# Altium schematic sheet Control_Sense_TOP_VAC.SchDoc (part 1 of 4)
size A1 portrait; SheetNumber: 5; SheetTotal: 5
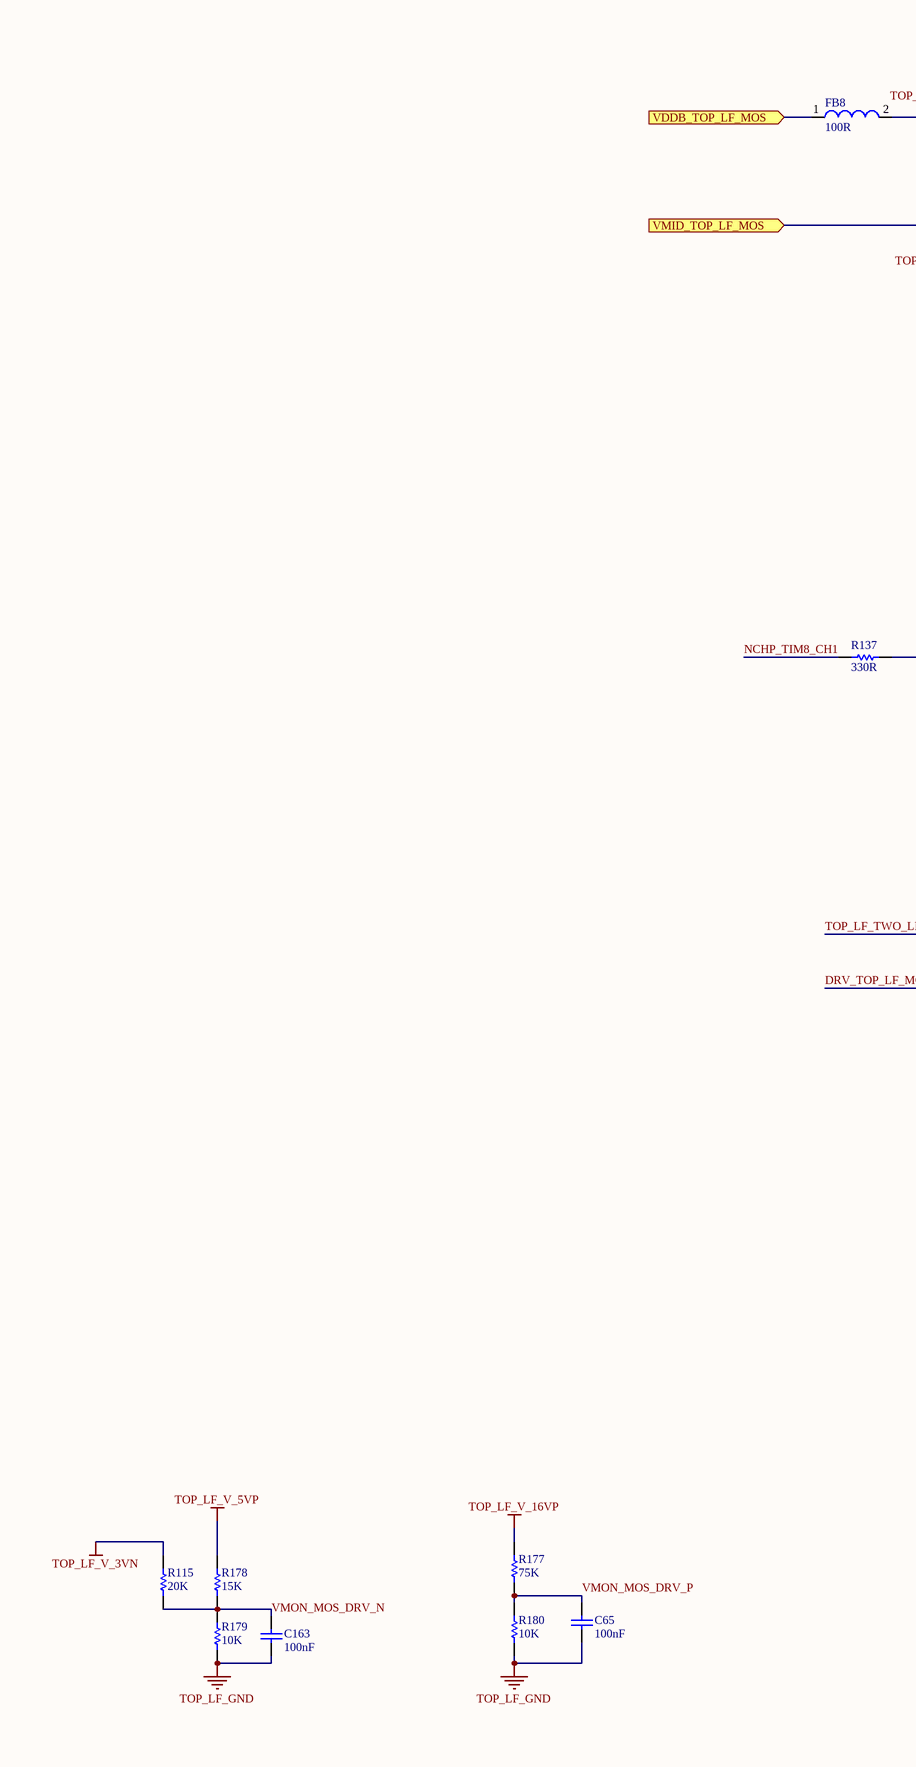
[diagram p0: Control_Sense_TOP_VAC.SchDoc, top left]
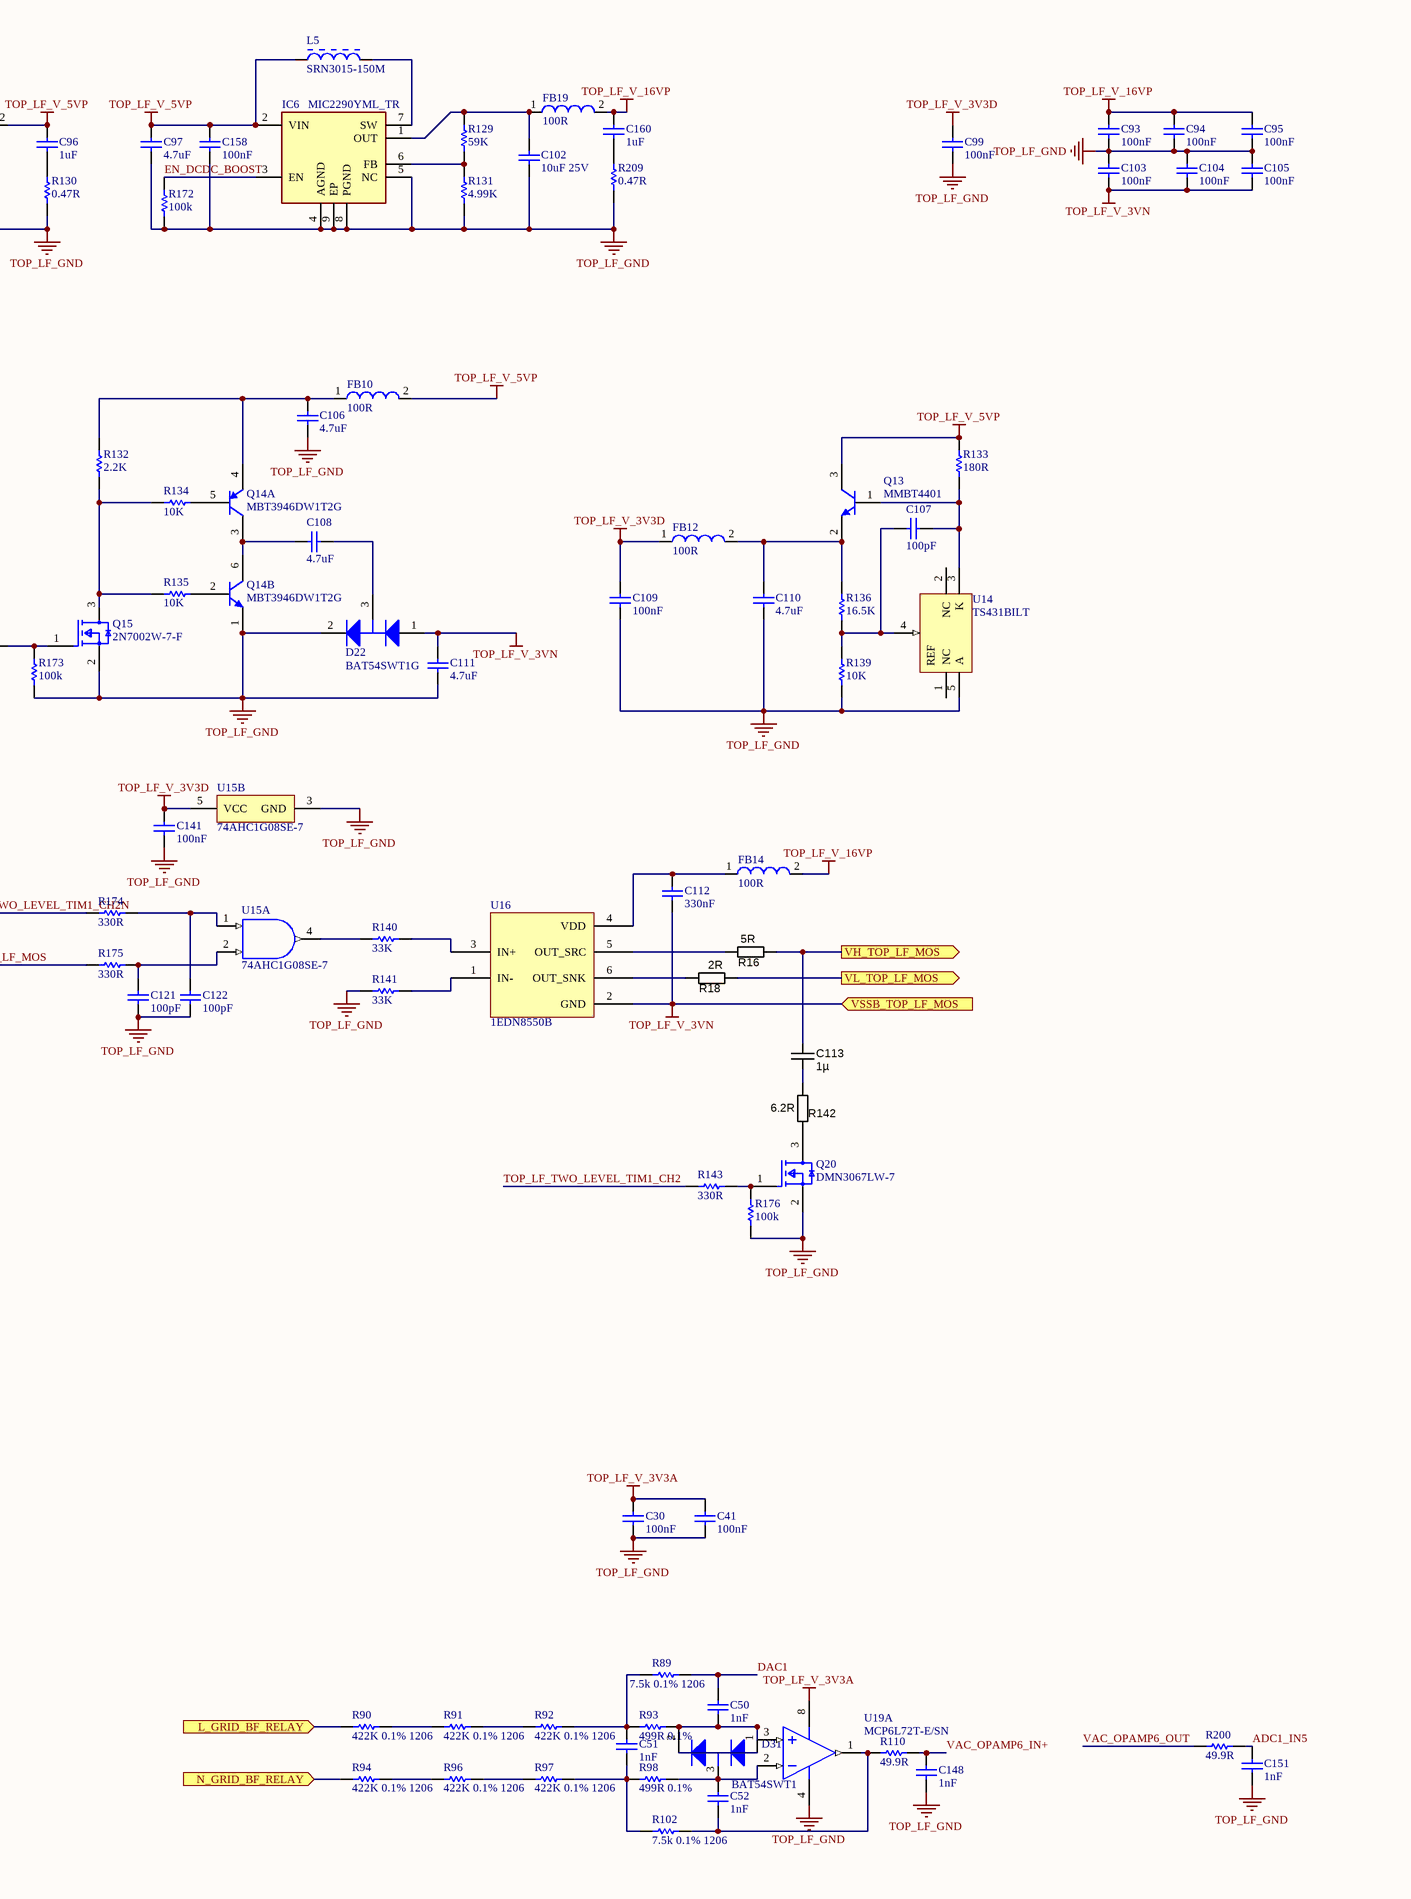
[diagram p1: Control_Sense_TOP_VAC.SchDoc, top right]
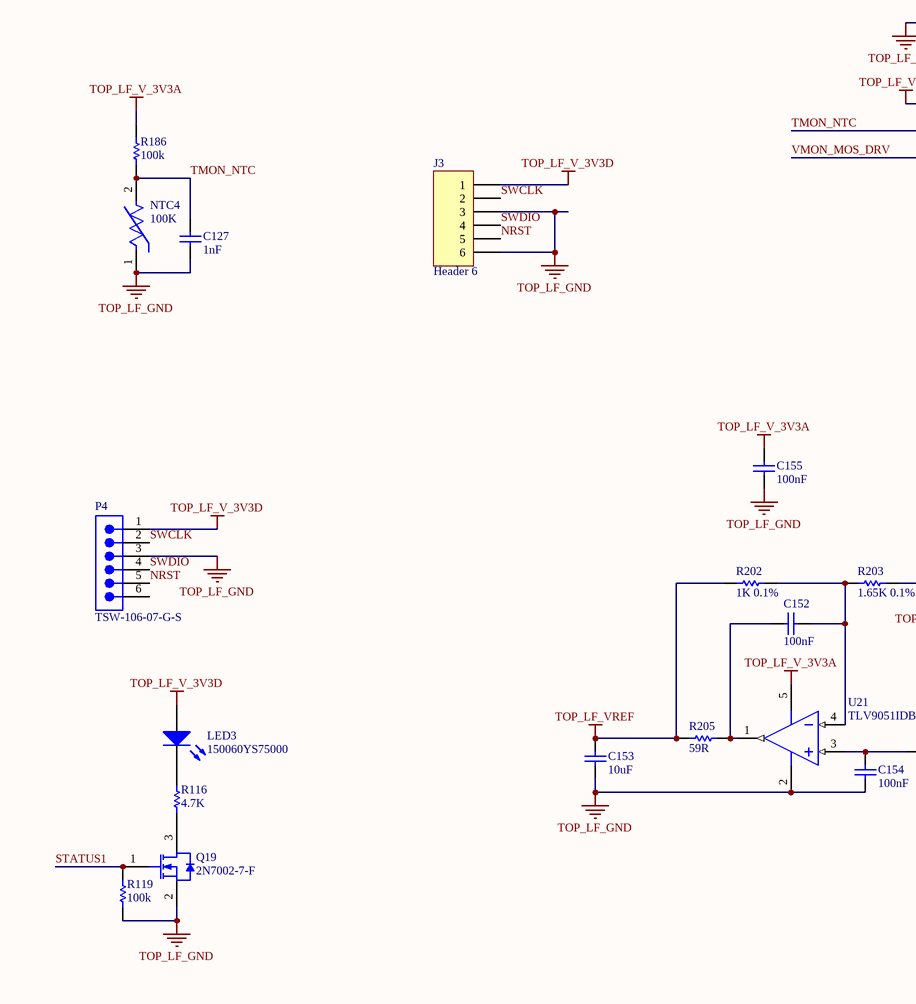
[diagram p2: Control_Sense_TOP_VAC.SchDoc, bottom left]
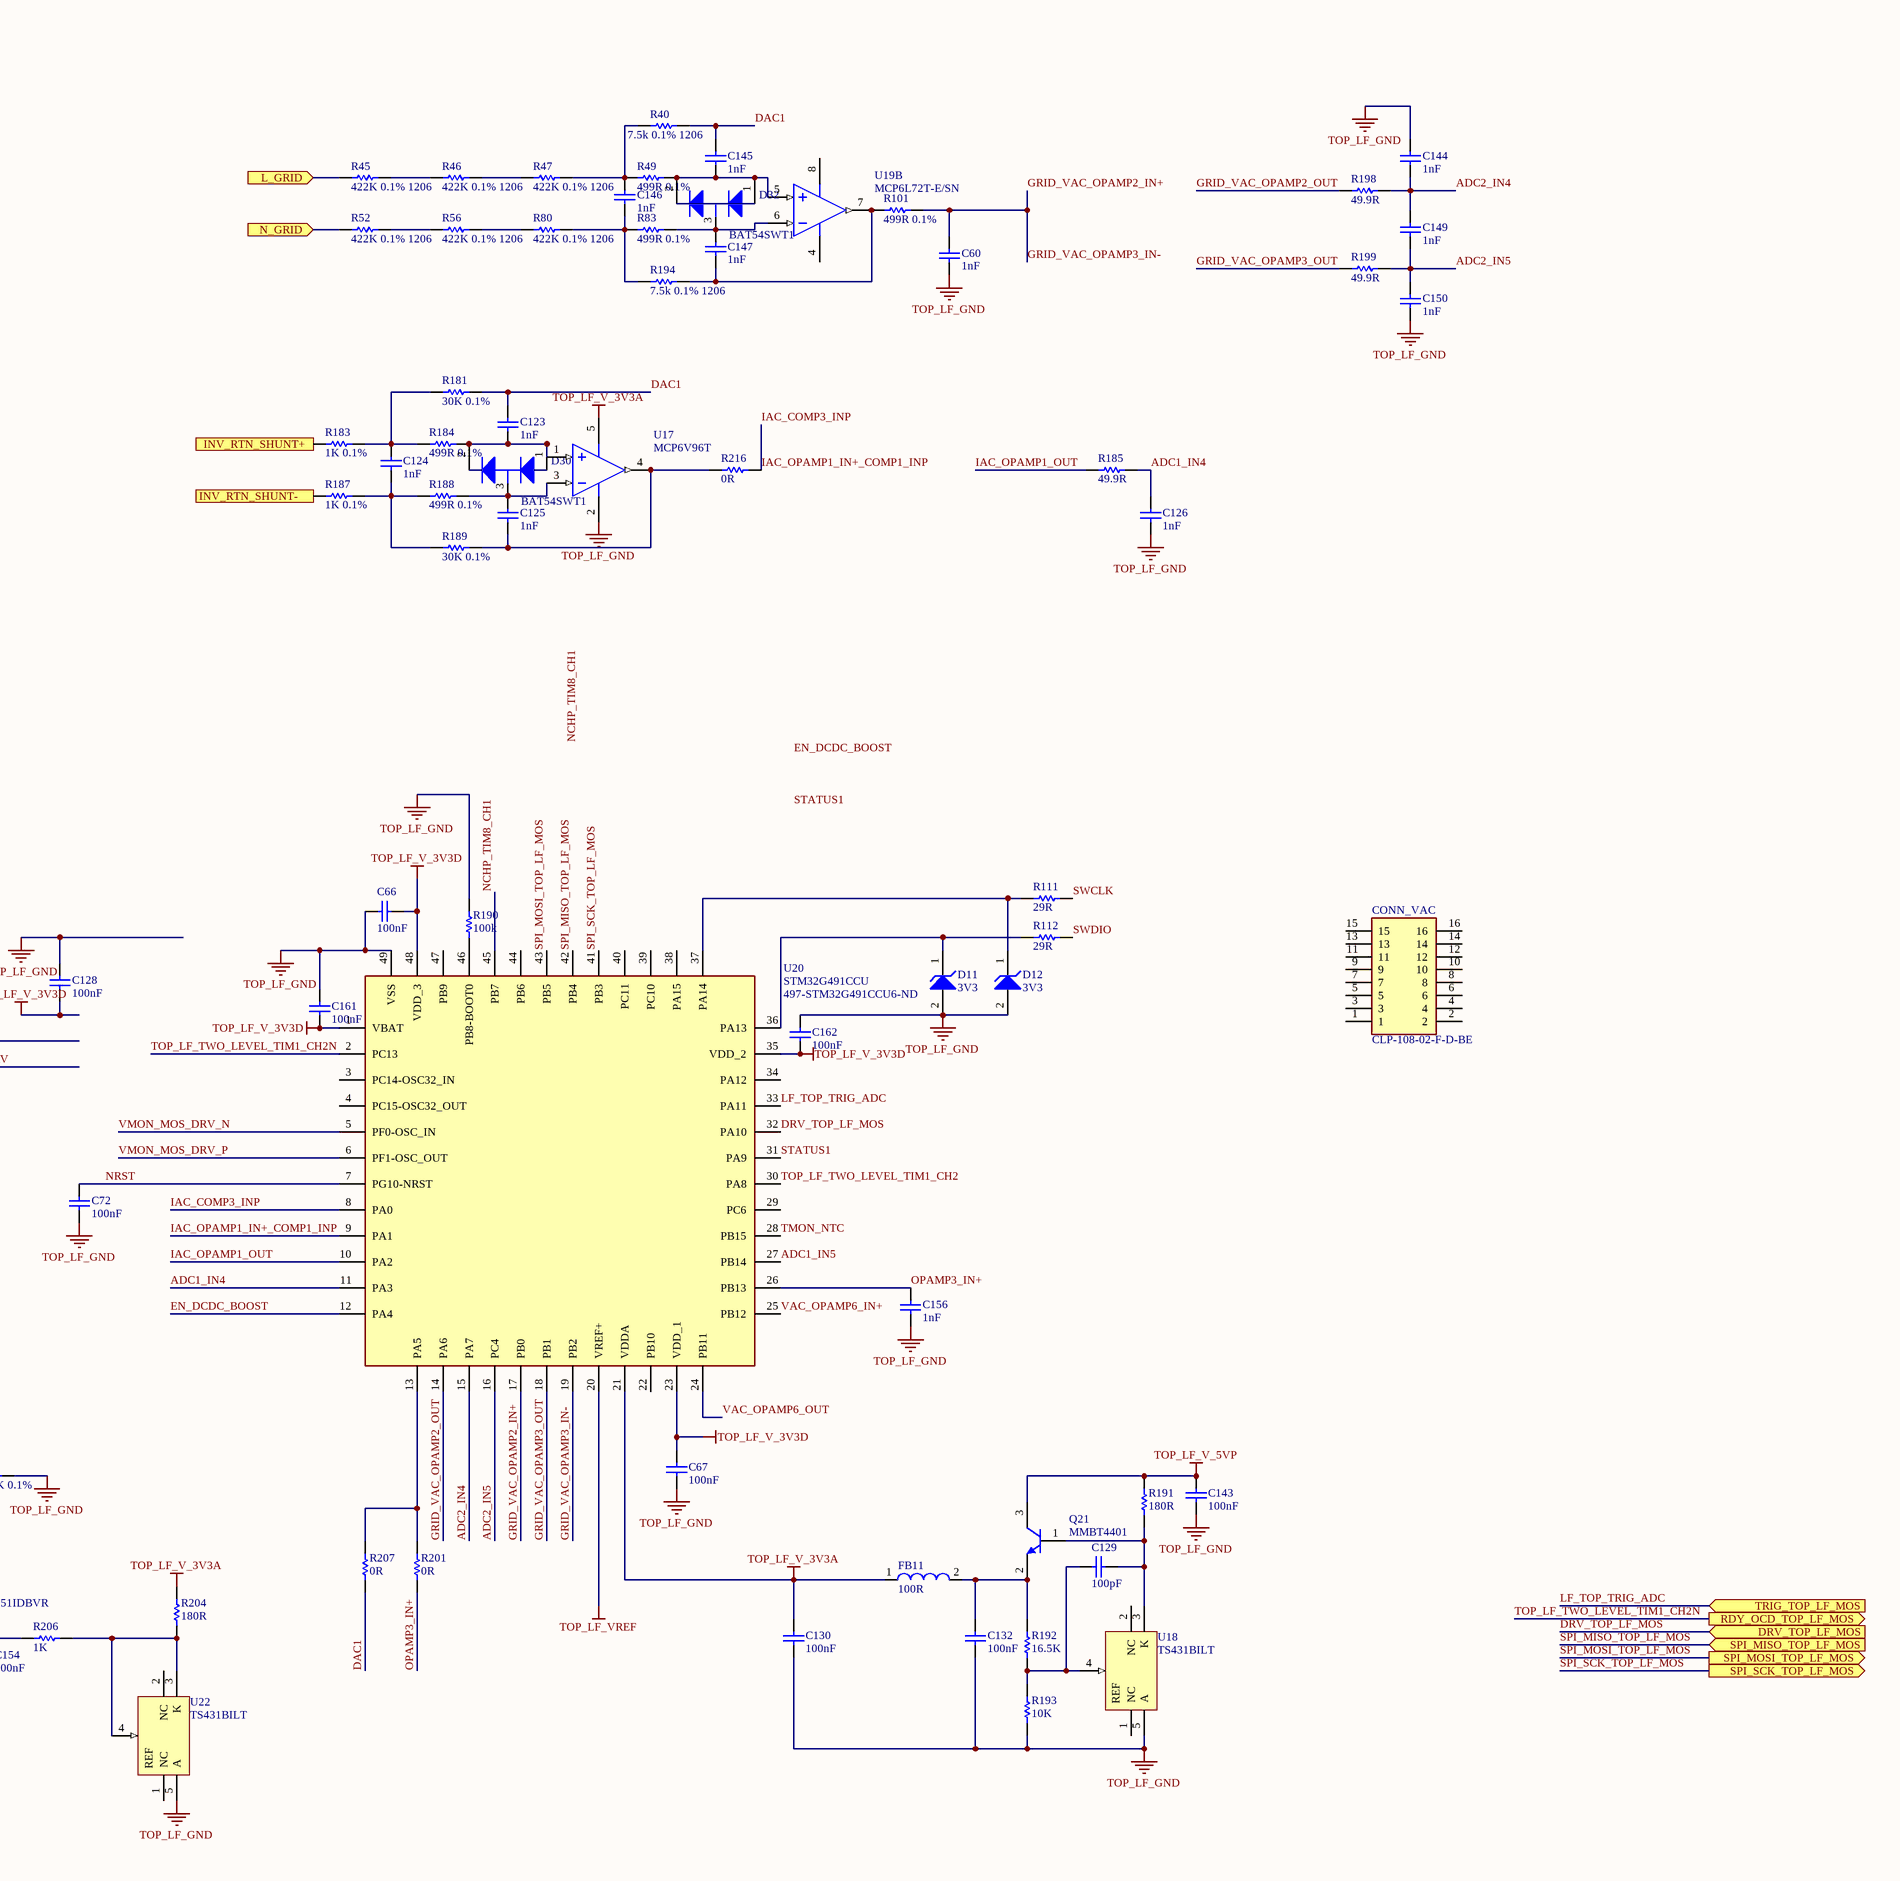
[diagram p3: Control_Sense_TOP_VAC.SchDoc, bottom right]

## Parts
C30  100nF  [SAMS-C0603-2_N]
C41  100nF  [SAMS-C0603-2_N]
C50  1nF  [CAPC1608X90X35NL15T15]
C51  1nF  [CAPC1608X90X35NL15T15]
C52  1nF  [CAPC1608X90X35NL15T15]
C60  1nF  [CAPC1608X90X35LL15T15]
C65  100nF  [CAPC1005X56X25NL10T15]
C66  100nF  [SAMS-C0603-2_L]
C67  100nF  [SAMS-C0603-2_L]
C72  100nF  [CAPC1005X56X25NL10T15]
C93  100nF  [CAPC1608X90X35NL15T15]
C94  100nF  [CAPC1608X90X35NL15T15]
C95  100nF  [CAPC1608X90X35NL15T15]
C96  1uF  [CAPC2013X140X50LL20T25]
C97  4.7uF  [CAPC2013X145X20NL20]
C99  100nF  [CAPC1608X90X35ML15T15]
C102  10uF 25V  [CAPC3216X229X50LL20T25]
C103  100nF  [CAPC1608X90X35NL15T15]
C104  100nF  [CAPC1608X90X35NL15T15]
C105  100nF  [CAPC1608X90X35NL15T15]
C106  4.7uF  [SAMS-C0603-2_L]
C107  100pF  [CAPC1608X90X35NL10T15]
C108  4.7uF  [SAMS-C0603-2_L]
C109  100nF  [SAMS-C0603-2_N]
C110  4.7uF  [CAPC1608X90X35LL15T15]
C111  4.7uF  [SAMS-C0603-2_L]
C112  330nF  [CAPC2013X135X45NL10T25]
C113  value 1µ  [CAPC2012X135N]  (hidden comment: approved sub OK)
C121  100pF  [CAPC1608X90X35NL10T15]
C122  100pF  [CAPC1608X90X35NL10T15]
C123  1nF  [CAPC1608X90X35NL15T15]
C124  1nF  [CAPC1608X90X35LL15T15]
C125  1nF  [CAPC1608X90X35NL15T15]
C126  1nF  [CAPC1005X56X25NL10T15]
C127  1nF  [CAPC1005X56X25NL10T15]
C128  100nF  [SAMS-C0603-2_N]
C129  100pF  [CAPC1608X90X35NL10T15]
C130  100nF  [SAMS-C0603-2_L]
C132  100nF  [SAMS-C0603-2_N]
C141  100nF  [CAPC1608X90X35LL15T15]
C143  100nF  [SAMS-C0603-2_N]
C144  1nF  [CAPC1005X56X25LL10T15]
C145  1nF  [CAPC1608X90X35NL15T15]
C146  1nF  [CAPC1608X90X35NL15T15]
C147  1nF  [CAPC1608X90X35NL15T15]
C148  1nF  [CAPC1005X56X25NL10T15]
C149  1nF  [CAPC1005X56X25LL10T15]
C150  1nF  [CAPC1005X56X25LL10T15]
C151  1nF  [CAPC1005X56X25NL10T15]
C152  100nF  [SAMS-C0603-2_L]
C153  10uF  [CAPC1608X90X35LL15T15]
C154  100nF  [SAMS-C0603-2_L]
C155  100nF  [SAMS-C0603-2_L]
C156  1nF  [CAPC1005X56X25LL10T15]
C158  100nF  [CAPC1608X90X35LL15T15]
C160  1uF  [CAPC2013X140X50LL20T25]
C161  100nF  [SAMS-C0603-2_L]
C162  100nF  [SAMS-C0603-2_L]
C163  100nF  [CAPC1005X56X25NL10T15]
CONN_VAC  CLP-108-02-F-D-BE  [CLP-108-02-XXX-D-BE]
D11  3V3  [ONSC-SOD-523-2-502-01_V]
D12  3V3  [ONSC-SOD-523-2-502-01_V]
D22  BAT54SWT1G  [ONSC-SOT-323-3-419-04_V]
D30  BAT54SWT1  [ONSC-SOT-323-3-419-04_V]
D31  BAT54SWT1  [ONSC-SOT-323-3-419-04_V]
D32  BAT54SWT1  [ONSC-SOT-323-3-419-04_V]
FB8  100R  [SMD-0603]
FB10  100R  [SMD-0603]
FB11  100R  [SMD-0603]
FB12  100R  [SMD-0603]
FB14  100R  [SMD-0603]
FB19  100R  [SMD-0603]
IC6  MIC2290YML_TR  [SON50P200X200X95-9N-D]
J3  Header 6  [HDR1X6]
L5  SRN3015-150M  [BOUR-SRN3015-2_V]
LED3  150060YS75000  [0603_A]
NTC4  100K  [FP-NXR_151B030-MFG]
P4  TSW-106-07-G-S  [SMTC-TSW-106-07-X-S]
Q13  MMBT4401  [FAIR-SOT23-3_V]
Q14  MBT3946DW1T2G  [ONSC-SC70-6-419B-02_W_V]  (parts A,B of 2)
Q15  2N7002W-7-F  [FP-SOT323-IPC_B]
Q19  2N7002-7-F  [DIOD-SOT23-3_V]
Q20  DMN3067LW-7  [FP-SOT323-IPC_C]
Q21  MMBT4401  [SOT23-3]
R16  5R  [RESC2012X70N]
R18  2R  [RESC2012X70N]
R40  7.5k 0.1% 1206  [RESC3216X50X50NL20T20]
R45  422K 0.1% 1206  [RESC1206(3216)_N]
R46  422K 0.1% 1206  [RESC1206(3216)_N]
R47  422K 0.1% 1206  [RESC1206(3216)_N]
R49  499R 0.1%  [RESC1608X55X30LL20T20]
R52  422K 0.1% 1206  [RESC1206(3216)_N]
R56  422K 0.1% 1206  [RESC1206(3216)_N]
R80  422K 0.1% 1206  [RESC1206(3216)_N]
R83  499R 0.1%  [RESC1608X55X30LL20T20]
R89  7.5k 0.1% 1206  [RESC3216X50X50NL20T20]
R90  422K 0.1% 1206  [RESC1206(3216)_N]
R91  422K 0.1% 1206  [RESC1206(3216)_N]
R92  422K 0.1% 1206  [RESC1206(3216)_N]
R93  499R 0.1%  [RESC1608X55X30LL20T20]
R94  422K 0.1% 1206  [RESC1206(3216)_N]
R96  422K 0.1% 1206  [RESC1206(3216)_N]
R97  422K 0.1% 1206  [RESC1206(3216)_N]
R98  499R 0.1%  [RESC1608X55X30LL20T20]
R101  499R 0.1%  [RESC1608X55X30LL20T20]
R102  7.5k 0.1% 1206  [RESC3216X50X50NL20T20]
R110  49.9R  [RESC1005X40X25NL05T05]
R111  29R  [RESC1608X55X30NL20T10]
R112  29R  [RESC1608X55X30NL20T10]
R115  20K  [RESC1608X55X30NL20T10]
R116  4.7K  [RESC1608X55X25ML10T15]
R119  100k  [RESC1608X55X25ML10T15]
R129  59K  [RESC1608X55X30NL15T15]
R130  0.47R  [RESC1608X55X25ML10T15]
R131  4.99K  [RESC1609X50X30NL10T20]
R132  2.2K  [RESC1608X55X25NL10T15]
R133  180R  [RESC1608X55X25LL10T15]
R134  10K  [RESC1608X55X30NL20T10]
R135  10K  [RESC1608X55X30NL20T10]
R136  16.5K  [RESC1608X55X30NL15T15]
R137  330R  [RESC1608X55X25NL10T15]
R139  10K  [RESC1609X55X30LL15T15]
R140  33K  [RESC1005X40X25ML05T05]
R141  33K  [RESC1005X40X25ML05T05]
R142  6.2R  [RESC2012X70N]
R143  330R  [RESC1608X55X25NL10T15]
R172  100k  [RESC1608X55X30NL15T15]
R173  100k  [RESC1608X55X30NL15T15]
R174  330R  [RESC1608X55X25NL10T15]
R175  330R  [RESC1608X55X25NL10T15]
R176  100k  [RESC1608X55X30NL15T15]
R177  75K  [RESC1608X55X30NL15T15]
R178  15K  [RESC1608X55X30NL20T10]
R179  10K  [RESC1608X55X30NL20T10]
R180  10K  [RESC1608X55X30NL20T10]
R181  30K 0.1%  [RESC1608X55N]
R183  1K 0.1%  [RESC1608X55X25NL10T15]
R184  499R 0.1%  [RESC1608X55N]
R185  49.9R  [RESC1005X40X25NL05T05]
R186  100k  [RESC1608X55X30NL15T15]
R187  1K 0.1%  [RESC1608X55X25NL10T15]
R188  499R 0.1%  [RESC1608X55N]
R189  30K 0.1%  [RESC1608X55N]
R190  100k  [RESC1608X55X30NL15T15]
R191  180R  [RESC1608X55X25LL10T15]
R192  16.5K  [RESC1608X55X30NL15T15]
R193  10K  [RESC1609X55X30NL15T15]
R194  7.5k 0.1% 1206  [RESC3216X50X50NL20T20]
R198  49.9R  [RESC1005X40X25NL05T05]
R199  49.9R  [RESC1005X40X25NL05T05]
R200  49.9R  [RESC1005X40X25NL05T05]
R201  0R  [RESC1005X40X25NL05T05]
R202  1K 0.1%  [RESC1608X55X30LL20T20]
R203  1.65K 0.1%  [RESC1608X55X30LL20T20]
R204  180R  [RESC1608X55X25LL10T15]
R205  59R  [RESC1608X55X30ML15T15]
R206  1K  [RESC1608X55X30NL20T10]
R207  0R  [RESC1005X40X25NL05T05]
R209  0.47R  [RESC1608X55X25ML10T15]
R216  0R  [RESC1608X55X25NL10T15]
U14  TS431BILT  [SOT23-5]
U15  74AHC1G08SE-7  [DCK0005A_M]  (parts A,B of 2)
U16  1EDN8550B  [SOT23-6]
U17  MCP6V96T  [DCK0005A_N]
U18  TS431BILT  [SOT23-5]
U19  MCP6L72T-E/SN  [SOP65P490X109-8N]  (parts A,B of 2)
U20  STM32G491CCU  Supplier Part Number 1: 497-STM32G491CCU6-ND  [QFN50P700X700X65-49N-D]
U21  TLV9051IDBVR  [SOT23-5]
U22  TS431BILT  [SOT23-5]

## Ports
DRV_TOP_LF_MOS (in), INV_RTN_SHUNT+ (in), INV_RTN_SHUNT- (in), L_GRID (in), L_GRID_BF_RELAY (in), N_GRID (in), N_GRID_BF_RELAY (in), RDY_OCD_TOP_LF_MOS (out), SPI_MISO_TOP_LF_MOS (in), SPI_MOSI_TOP_LF_MOS (out), SPI_SCK_TOP_LF_MOS (out), TRIG_TOP_LF_MOS (in), VDDB_TOP_LF_MOS (in), VH_TOP_LF_MOS (out), VL_TOP_LF_MOS (out), VMID_TOP_LF_MOS (in), VSSB_TOP_LF_MOS (in)

## Nets
TOP_LF_GND: C30.1 C41.1 C60.2 C65.1 C66.2 C67.1 C72.1 C93.1 C94.1 C95.1 C97.1 C99.1 C102.1 C103.2 C104.2 C105.2 C106.1 C109.1 C110.1 C111.1 C121.1 C122.1 C126.1 C127.1 C128.2 C130.1 C132.1 C141.1 C143.1 C144.2 C148.1 C150.1 C151.1 C153.1 C154.1 C155.1 C156.1 C158.1 C161.2 C162.2 C163.1 D11.2(A) D12.2(A) D22.2(K) IC6.4(AGND) IC6.5(NC) IC6.8(PGND) IC6.9(EP) J3.3 J3.6 NTC4.1 P4.3 Q14.1(E) Q15.2(S) Q19.2(S) Q20.2(S) R119.1 R130.1 R131.1 R139.1 R141.1 R172.1 R173.1 R176.1 R179.1 R180.2 R190.1 R193.1 R203.2 R209.1 U14.5(A) U15.3(GND) U17.2(V-) U18.5(A) U19.4(VSS) U20.49(VSS) U21.2(VSS) U22.5(A) ; port VMID_TOP_LF_MOS
TOP_LF_V_3V3A: C30.2 C41.2 C130.2 C155.2 FB11.1 R186.2 R204.2 U17.5(V+) U19.8(VDD) U20.21(VDDA) U21.5(VDD)
TOP_LF_V_3V3D: C66.1 C67.2 C99.2 C109.2 C128.1 C141.2 C161.1 C162.1 FB12.1 J3.1 LED3.2(A) P4.1 U15.5(VCC) U20.1(VBAT) U20.23(VDD_1) U20.35(VDD_2) U20.48(VDD_3)
TOP_LF_V_3VN: C103.1 C104.1 C105.1 C111.2 C112.1 D22.1(A) R115.2 U16.2(GND) ; port VSSB_TOP_LF_MOS
TOP_LF_V_5VP: C96.2 C97.2 C143.2 C158.2 FB8.2 FB10.2 IC6.2(VIN) L5.1 Q13.3(C) Q21.3(C) R133.2 R178.2 R191.2
TOP_LF_V_16VP: C93.2 C94.2 C95.2 C160.2 FB14.2 FB19.2 R177.1
TOP_LF_VREF: C153.2 R202.1 R205.1 U20.20(VREF+)
ADC1_IN4: C126.2 R185.2 U20.11(PA3)
ADC1_IN5: C151.2 R200.2 U20.27(PB14)
ADC2_IN4: C144.1 C149.2 R198.2 U20.15(PA7)
ADC2_IN5: C149.1 C150.2 R199.2 U20.16(PC4)
DAC1: C50.2 C123.2 C145.2 R40.1 R89.1 R181.2 R207.2
DRV_TOP_LF_MOS: R175.1 U20.32(PA10) ; port DRV_TOP_LF_MOS
EN_DCDC_BOOST: IC6.3(EN) R172.2 U20.12(PA4)
GRID_VAC_OPAMP2_IN+: C60.1 R101.2 U20.17(PB0) U20.19(PB2)  [also labelled GRID_VAC_OPAMP3_IN-]
GRID_VAC_OPAMP2_OUT: R198.1 U20.14(PA6)
GRID_VAC_OPAMP3_OUT: R199.1 U20.18(PB1)
IAC_COMP3_INP: R216.2 U20.8(PA0) U20.9(PA1)  [also labelled IAC_OPAMP1_IN+_COMP1_INP]
IAC_OPAMP1_OUT: R185.1 U20.10(PA2)
INV_RTN_SHUNT+: R183.1 ; port INV_RTN_SHUNT+
INV_RTN_SHUNT-: R187.1 ; port INV_RTN_SHUNT-
L_GRID: R45.2 ; port L_GRID
L_GRID_BF_RELAY: R90.2 ; port L_GRID_BF_RELAY
LF_TOP_TRIG_ADC: U20.33(PA11) ; port TRIG_TOP_LF_MOS
N_GRID: R52.2 ; port N_GRID
N_GRID_BF_RELAY: R94.2 ; port N_GRID_BF_RELAY
NCHP_TIM8_CH1: R137.1 U20.45(PB7)
NRST: C72.2 J3.5 P4.5 U20.7(PG10-NRST)
OPAMP3_IN+: C156.2 R201.2 U20.26(PB13)
SPI_MISO_TOP_LF_MOS: U20.42(PB4) ; port SPI_MISO_TOP_LF_MOS
SPI_MOSI_TOP_LF_MOS: U20.43(PB5) ; port SPI_MOSI_TOP_LF_MOS
SPI_SCK_TOP_LF_MOS: U20.41(PB3) ; port SPI_SCK_TOP_LF_MOS
STATUS1: Q19.1(G) R119.2 U20.31(PA9)
SWCLK: J3.2 P4.2 R111.2
SWDIO: J3.4 P4.4 R112.2
TMON_NTC: C127.2 NTC4.2 R186.1 U20.28(PB15)
TOP_LF_TWO_LEVEL_TIM1_CH2: R143.1 U20.30(PA8)
TOP_LF_TWO_LEVEL_TIM1_CH2N: R174.1 U20.2(PC13) ; port RDY_OCD_TOP_LF_MOS
VAC_OPAMP6_IN+: C148.2 R110.2 U20.25(PB12)
VAC_OPAMP6_OUT: R200.1 U20.24(PB11)
VDDB_TOP_LF_MOS: FB8.1 ; port VDDB_TOP_LF_MOS
VH_TOP_LF_MOS: C113.1 R16.2 ; port VH_TOP_LF_MOS
VL_TOP_LF_MOS: R18.2 ; port VL_TOP_LF_MOS
VMON_MOS_DRV_N: C163.2 R115.1 R178.1 R179.2 U20.5(PF0-OSC_IN)
VMON_MOS_DRV_P: C65.2 R177.2 R180.1 U20.6(PF1-OSC_OUT)
NetC50_1: C50.1 D31.1(A) D31.2(K) R93.2 U19.3(VINA+)
NetC51_1: C51.1 R97.1 R98.1 R102.2
NetC51_2: C51.2 R89.2 R92.1 R93.1
NetC52_1: C52.1 D31.3(K/A) R98.2 U19.2(VINA-)
NetC52_2: C52.2 R102.1 R110.1 U19.1(VOUTA)
NetC96_1: C96.1 R130.2
NetC102_2: C102.2 FB19.1 IC6.1(OUT) R129.2
NetC106_2: C106.2 FB10.1 Q14.4(E) R132.2
NetC107_1: C107.1 R136.1 R139.2 U14.4(REF)
NetC107_2: C107.2 Q13.1(B) R133.1 U14.3(K)
NetC108_1: C108.1 D22.3(K/A)
NetC108_2: C108.2 Q14.3(C) Q14.6(C)
NetC110_2: C110.2 FB12.2 Q13.2(E) R136.2
NetC112_2: C112.2 FB14.1 U16.4(VDD)
NetC113_2: C113.2 R142.2
NetC121_2: C121.2 R175.2 U15.2(B)
NetC122_2: C122.2 R174.2 U15.1(A)
NetC123_1: C123.1 D30.1(A) D30.2(K) R184.2 U17.1(IN+)
NetC124_1: C124.1 R187.2 R188.1 R189.1
NetC124_2: C124.2 R181.1 R183.2 R184.1
NetC125_1: C125.1 D30.3(K/A) R188.2 U17.3(IN-)
NetC125_2: C125.2 R189.2 R216.1 U17.4(OUT)
NetC129_1: C129.1 R192.1 R193.2 U18.4(REF)
NetC129_2: C129.2 Q21.1(B) R191.1 U18.3(K)
NetC132_2: C132.2 FB11.2 Q21.2(E) R192.2
NetC145_1: C145.1 D32.1(A) D32.2(K) R49.2 U19.5(VINB+)
NetC146_1: C146.1 R80.1 R83.1 R194.2
NetC146_2: C146.2 R40.2 R47.1 R49.1
NetC147_1: C147.1 D32.3(K/A) R83.2 U19.6(VINB-)
NetC147_2: C147.2 R101.1 R194.1 U19.7(VOUTB)
NetC152_1: C152.1 R202.2 R203.1 U21.4(VIN-)
NetC152_2: C152.2 R205.2 U21.1(VOUT)
NetC154_2: C154.2 R206.1 U21.3(VIN+)
NetC160_1: C160.1 R209.2
NetD11_1: D11.1(K) R112.1 U20.36(PA13)
NetD12_1: D12.1(K) R111.1 U20.37(PA14)
NetIC6_6: IC6.6(FB) R129.1 R131.2
NetIC6_7: IC6.7(SW) L5.2
NetLED3_1: LED3.1(K) R116.2
NetQ14_2: Q14.2(B) R135.2
NetQ14_5: Q14.5(B) R134.2
NetQ15_1: Q15.1(G) R137.2 R173.2
NetQ15_3: Q15.3(D) R132.1 R134.1 R135.1
NetQ19_3: Q19.3(D) R116.1
NetQ20_1: Q20.1(G) R143.2 R176.2
NetQ20_3: Q20.3(D) R142.1
NetR16_1: R16.1 U16.5(OUT_SRC)
NetR18_1: R18.1 U16.6(OUT_SNK)
NetR45_1: R45.1 R46.2
NetR46_1: R46.1 R47.2
NetR52_1: R52.1 R56.2
NetR56_1: R56.1 R80.2
NetR90_1: R90.1 R91.2
NetR91_1: R91.1 R92.2
NetR94_1: R94.1 R96.2
NetR96_1: R96.1 R97.2
NetR140_1: R140.1 U15.4(Y)
NetR140_2: R140.2 U16.3(IN+)
NetR141_2: R141.2 U16.1(IN-)
NetR190_2: R190.2 U20.46(PB8-BOOT0)
NetR201_1: R201.1 R207.1 U20.13(PA5)
NetR204_1: R204.1 R206.2 U22.3(K) U22.4(REF)

Not connected (* = marked no-connect by the designer): CONN_VAC 1 2 3 4 5 6 7 8 9 10 11 12 13 14 15 16; P4 6; U14 1(NC) 2(NC); U18 1(NC) 2(NC); U20 3(PC14-OSC32_IN) 4(PC15-OSC32_OUT) 22(PB10) 29(PC6) 34(PA12) 38(PA15) 39(PC10) 40(PC11) 44(PB6) 47(PB9); U22 1(NC) 2(NC)

## Notes on the sheet
- Labels drawn without touching a wire or pin: EN_DCDC_BOOST, NCHP_TIM8_CH1, STATUS1